# Altium schematic sheet TEC.SchDoc
size 420 x 297 mm; SheetNumber: 14; SheetTotal: 19
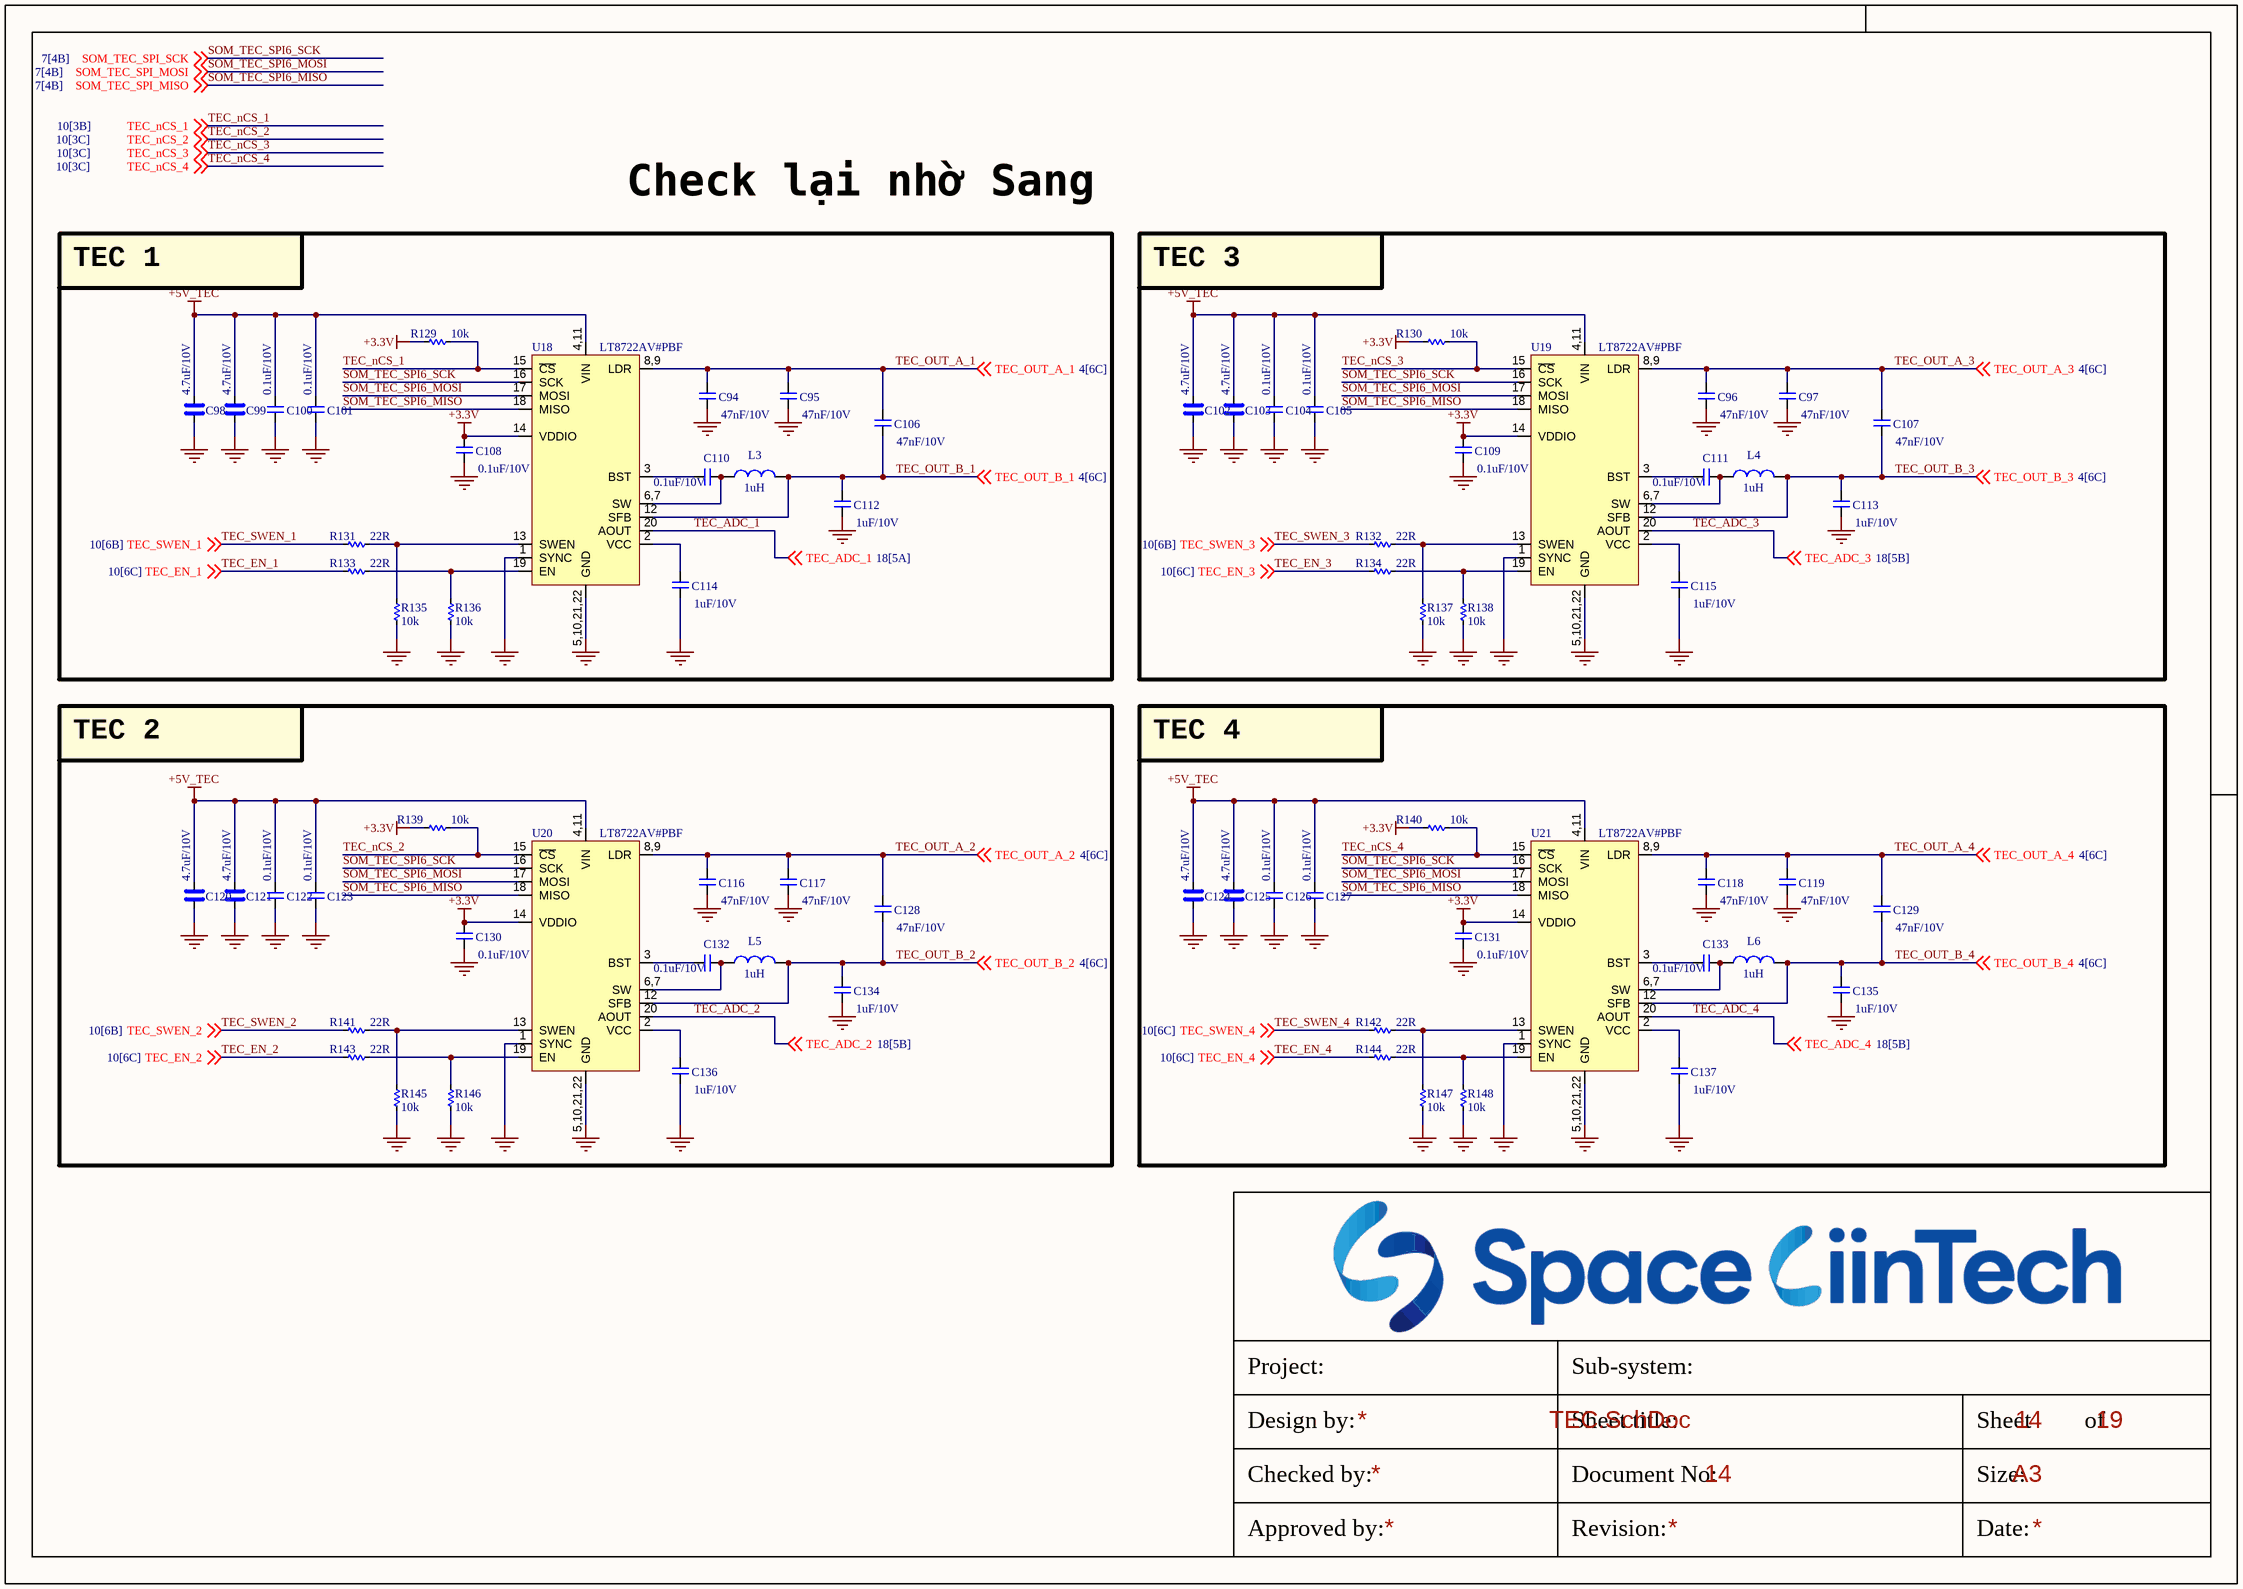
[diagram p0: TEC.SchDoc]

## Parts
C94  47nF/10V  [CAP_C_1005X60]
C95  47nF/10V  [CAP_C_1005X60]
C96  47nF/10V  [CAP_C_1005X60]
C97  47nF/10V  [CAP_C_1005X60]
C98  4.7uF/10V  [CAP_C_1608X80]
C99  4.7uF/10V  [CAP_C_1608X80]
C100  0.1uF/10V  [CAP_C_1005X60]
C101  0.1uF/10V  [CAP_C_1005X60]
C102  4.7uF/10V  [CAP_C_1608X80]
C103  4.7uF/10V  [CAP_C_1608X80]
C104  0.1uF/10V  [CAP_C_1005X60]
C105  0.1uF/10V  [CAP_C_1005X60]
C106  47nF/10V  [CAP_C_1005X60]
C107  47nF/10V  [CAP_C_1005X60]
C108  0.1uF/10V  [CAP_C_1005X60]
C109  0.1uF/10V  [CAP_C_1005X60]
C110  0.1uF/10V  [CAP_C_1005X60]
C111  0.1uF/10V  [CAP_C_1005X60]
C112  1uF/10V  [CAP_C_1005X60]
C113  1uF/10V  [CAP_C_1005X60]
C114  1uF/10V  [CAP_C_1005X60]
C115  1uF/10V  [CAP_C_1005X60]
C116  47nF/10V  [CAP_C_1005X60]
C117  47nF/10V  [CAP_C_1005X60]
C118  47nF/10V  [CAP_C_1005X60]
C119  47nF/10V  [CAP_C_1005X60]
C120  4.7uF/10V  [CAP_C_1608X80]
C121  4.7uF/10V  [CAP_C_1608X80]
C122  0.1uF/10V  [CAP_C_1005X60]
C123  0.1uF/10V  [CAP_C_1005X60]
C124  4.7uF/10V  [CAP_C_1608X80]
C125  4.7uF/10V  [CAP_C_1608X80]
C126  0.1uF/10V  [CAP_C_1005X60]
C127  0.1uF/10V  [CAP_C_1005X60]
C128  47nF/10V  [CAP_C_1005X60]
C129  47nF/10V  [CAP_C_1005X60]
C130  0.1uF/10V  [CAP_C_1005X60]
C131  0.1uF/10V  [CAP_C_1005X60]
C132  0.1uF/10V  [CAP_C_1005X60]
C133  0.1uF/10V  [CAP_C_1005X60]
C134  1uF/10V  [CAP_C_1005X60]
C135  1uF/10V  [CAP_C_1005X60]
C136  1uF/10V  [CAP_C_1005X60]
C137  1uF/10V  [CAP_C_1005X60]
L3  1uH  [L-SMD-M-3.5x3.5x2mm]
L4  1uH  [L-SMD-M-3.5x3.5x2mm]
L5  1uH  [L-SMD-M-3.5x3.5x2mm]
L6  1uH  [L-SMD-M-3.5x3.5x2mm]
R129  10k  [RES_C_1005X40]
R130  10k  [RES_C_1005X40]
R131  22R  [RES_C_1005X40]
R132  22R  [RES_C_1005X40]
R133  22R  [RES_C_1005X40]
R134  22R  [RES_C_1005X40]
R135  10k  [RES_C_1005X40]
R136  10k  [RES_C_1005X40]
R137  10k  [RES_C_1005X40]
R138  10k  [RES_C_1005X40]
R139  10k  [RES_C_1005X40]
R140  10k  [RES_C_1005X40]
R141  22R  [RES_C_1005X40]
R142  22R  [RES_C_1005X40]
R143  22R  [RES_C_1005X40]
R144  22R  [RES_C_1005X40]
R145  10k  [RES_C_1005X40]
R146  10k  [RES_C_1005X40]
R147  10k  [RES_C_1005X40]
R148  10k  [RES_C_1005X40]
U18  LT8722AV#PBF  [QFN18]
U19  LT8722AV#PBF  [QFN18]
U20  LT8722AV#PBF  [QFN18]
U21  LT8722AV#PBF  [QFN18]

## Blocks framed on the sheet
TEC 1: C94 C95 C98-C101 C106 C108 C110 C112 C114 L3 R129 R131 R133 R135 R136 U18
TEC 3: C96 C97 C102-C105 C107 C109 C111 C113 C115 L4 R130 R132 R134 R137 R138 U19
TEC 2: C116 C117 C120-C123 C128 C130 C132 C134 C136 L5 R139 R141 R143 R145 R146 U20
TEC 4: C118 C119 C124-C127 C129 C131 C133 C135 C137 L6 R140 R142 R144 R147 R148 U21

## Nets
+3.3V: C108.2 C109.2 C130.2 C131.2 R129.1 R130.1 R139.1 R140.1 U18.14(VDDIO) U19.14(VDDIO) U20.14(VDDIO) U21.14(VDDIO)
+5V_TEC: C98.2 C99.2 C100.2 C101.2 C102.2 C103.2 C104.2 C105.2 C120.2 C121.2 C122.2 C123.2 C124.2 C125.2 C126.2 C127.2 U18.4,11(VIN) U19.4,11(VIN) U20.4,11(VIN) U21.4,11(VIN)
GND: C94.1 C95.1 C96.1 C97.1 C98.1 C99.1 C100.1 C101.1 C102.1 C103.1 C104.1 C105.1 C108.1 C109.1 C112.1 C113.1 C114.1 C115.1 C116.1 C117.1 C118.1 C119.1 C120.1 C121.1 C122.1 C123.1 C124.1 C125.1 C126.1 C127.1 C130.1 C131.1 C134.1 C135.1 C136.1 C137.1 R135.2 R136.2 R137.2 R138.2 R145.2 R146.2 R147.2 R148.2 U18.1(SYNC) U18.5,10,21,22(GND) U19.1(SYNC) U19.5,10,21,22(GND) U20.1(SYNC) U20.5,10,21,22(GND) U21.1(SYNC) U21.5,10,21,22(GND)
SOM_TEC_SPI6_MISO: U18.18(MISO) U19.18(MISO) U20.18(MISO) U21.18(MISO) ; off-sheet SOM_TEC_SPI_MISO  [also labelled SOM_TEC_SPI_MISO]
SOM_TEC_SPI6_MOSI: U18.17(MOSI) U19.17(MOSI) U20.17(MOSI) U21.17(MOSI) ; off-sheet SOM_TEC_SPI_MOSI  [also labelled SOM_TEC_SPI_MOSI]
SOM_TEC_SPI6_SCK: U18.16(SCK) U19.16(SCK) U20.16(SCK) U21.16(SCK) ; off-sheet SOM_TEC_SPI_SCK  [also labelled SOM_TEC_SPI_SCK]
TEC_ADC_1: U18.20(AOUT) ; off-sheet TEC_ADC_1
TEC_ADC_2: U20.20(AOUT) ; off-sheet TEC_ADC_2
TEC_ADC_3: U19.20(AOUT) ; off-sheet TEC_ADC_3
TEC_ADC_4: U21.20(AOUT) ; off-sheet TEC_ADC_4
TEC_EN_1: R133.2 ; off-sheet TEC_EN_1
TEC_EN_2: R143.2 ; off-sheet TEC_EN_2
TEC_EN_3: R134.2 ; off-sheet TEC_EN_3
TEC_EN_4: R144.2 ; off-sheet TEC_EN_4
TEC_nCS_1: R129.2 U18.15(~{CS}) ; off-sheet TEC_nCS_1
TEC_nCS_2: R139.2 U20.15(~{CS}) ; off-sheet TEC_nCS_2
TEC_nCS_3: R130.2 U19.15(~{CS}) ; off-sheet TEC_nCS_3
TEC_nCS_4: R140.2 U21.15(~{CS}) ; off-sheet TEC_nCS_4
TEC_OUT_A_1: C94.2 C95.2 C106.2 U18.8,9(LDR) ; off-sheet TEC_OUT_A_1
TEC_OUT_A_2: C116.2 C117.2 C128.2 U20.8,9(LDR) ; off-sheet TEC_OUT_A_2
TEC_OUT_A_3: C96.2 C97.2 C107.2 U19.8,9(LDR) ; off-sheet TEC_OUT_A_3
TEC_OUT_A_4: C118.2 C119.2 C129.2 U21.8,9(LDR) ; off-sheet TEC_OUT_A_4
TEC_OUT_B_1: C106.1 C112.2 L3.2 U18.12(SFB) ; off-sheet TEC_OUT_B_1
TEC_OUT_B_2: C128.1 C134.2 L5.2 U20.12(SFB) ; off-sheet TEC_OUT_B_2
TEC_OUT_B_3: C107.1 C113.2 L4.2 U19.12(SFB) ; off-sheet TEC_OUT_B_3
TEC_OUT_B_4: C129.1 C135.2 L6.2 U21.12(SFB) ; off-sheet TEC_OUT_B_4
TEC_SWEN_1: R131.1 ; off-sheet TEC_SWEN_1
TEC_SWEN_2: R141.1 ; off-sheet TEC_SWEN_2
TEC_SWEN_3: R132.1 ; off-sheet TEC_SWEN_3
TEC_SWEN_4: R142.1 ; off-sheet TEC_SWEN_4
NetC110_1: C110.1 L3.1 U18.6,7(SW)
NetC110_2: C110.2 U18.3(BST)
NetC111_1: C111.1 L4.1 U19.6,7(SW)
NetC111_2: C111.2 U19.3(BST)
NetC114_2: C114.2 U18.2(VCC)
NetC115_2: C115.2 U19.2(VCC)
NetC132_1: C132.1 L5.1 U20.6,7(SW)
NetC132_2: C132.2 U20.3(BST)
NetC133_1: C133.1 L6.1 U21.6,7(SW)
NetC133_2: C133.2 U21.3(BST)
NetC136_2: C136.2 U20.2(VCC)
NetC137_2: C137.2 U21.2(VCC)
NetR131_2: R131.2 R135.1 U18.13(SWEN)
NetR132_2: R132.2 R137.1 U19.13(SWEN)
NetR133_1: R133.1 R136.1 U18.19(EN)
NetR134_1: R134.1 R138.1 U19.19(EN)
NetR141_2: R141.2 R145.1 U20.13(SWEN)
NetR142_2: R142.2 R147.1 U21.13(SWEN)
NetR143_1: R143.1 R146.1 U20.19(EN)
NetR144_1: R144.1 R148.1 U21.19(EN)

## Notes on the sheet
- Check lại nhờ Sang
- Project:
- Sub-system:
- Design by:
- Sheet title:
- Sheet
- of
- Checked by:
- Approved by:
- Revision:
- Document No:
- Size:
- Date:
- A3

## Library data of the parts
C94-C97 C100 C101 C104-C119 C122 C123 C126-C137 = _CAP_C_2: CAP CHIP
C98 C99 C102 C103 C120 C121 C124 C125 = _CAP_C_High_2: CAP CHIP High Value
L3-L6 = L-SMD-1: partNo: 78477010; Manufacturer: Wurth Elektronik; Inductance: 1.0 μH; ComponentLink1Description: Manufacturer; ComponentLink1URL: http://www.we-online.de; Created by: Baojun Chen; Created Date: Nov.2015; ComponentLink2Description: Datasheet; ComponentLink2URL: http://katalog.we-online.de/pbs/datasheet/78477010.pdf
R129-R148 = _RES_B_2: RES
U18-U21 = LT8722